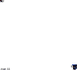
[diagram p0: schematic Draft1.asc]
Draft1.asc, the LTspice schematic file:
Version 4
SHEET 1 880 680
WIRE 80 64 -32 64
WIRE 256 64 80 64
WIRE 304 64 256 64
WIRE 80 112 80 64
WIRE 256 112 256 64
WIRE 208 176 80 176
WIRE 80 240 80 176
WIRE 176 320 80 320
WIRE 256 320 256 176
WIRE 256 320 176 320
WIRE 176 352 176 320
FLAG 176 352 0
SYMBOL Misc\\SCR 240 112 R0
SYMATTR InstName U1
SYMBOL zener 96 176 R180
WINDOW 0 24 64 Left 2
WINDOW 3 24 0 Left 2
SYMATTR InstName D1
SYMATTR Value MMBZ6V8ALY
SYMBOL res 64 224 R0
SYMATTR InstName R1
SYMATTR Value 30k
SYMBOL res -284224 -284112 R0
SYMATTR InstName R2
TEXT -284226 376 Left 2 !.tran 11

The netlist it stands for:
* Draft1.asc
* U1: SCR (symbol Misc\SCR not certain, pin order unknown); nets seen at it: 0, N001, N002
D1 N002 N001 MMBZ6V8ALY
R1 N002 0 30k
R2 NC_01 NC_02 R
.model D D
.lib standard.dio
.tran 11
.backanno
.end